# EAGLE design Nappe2.0 _ V2 (EAGLE 9.6.2)
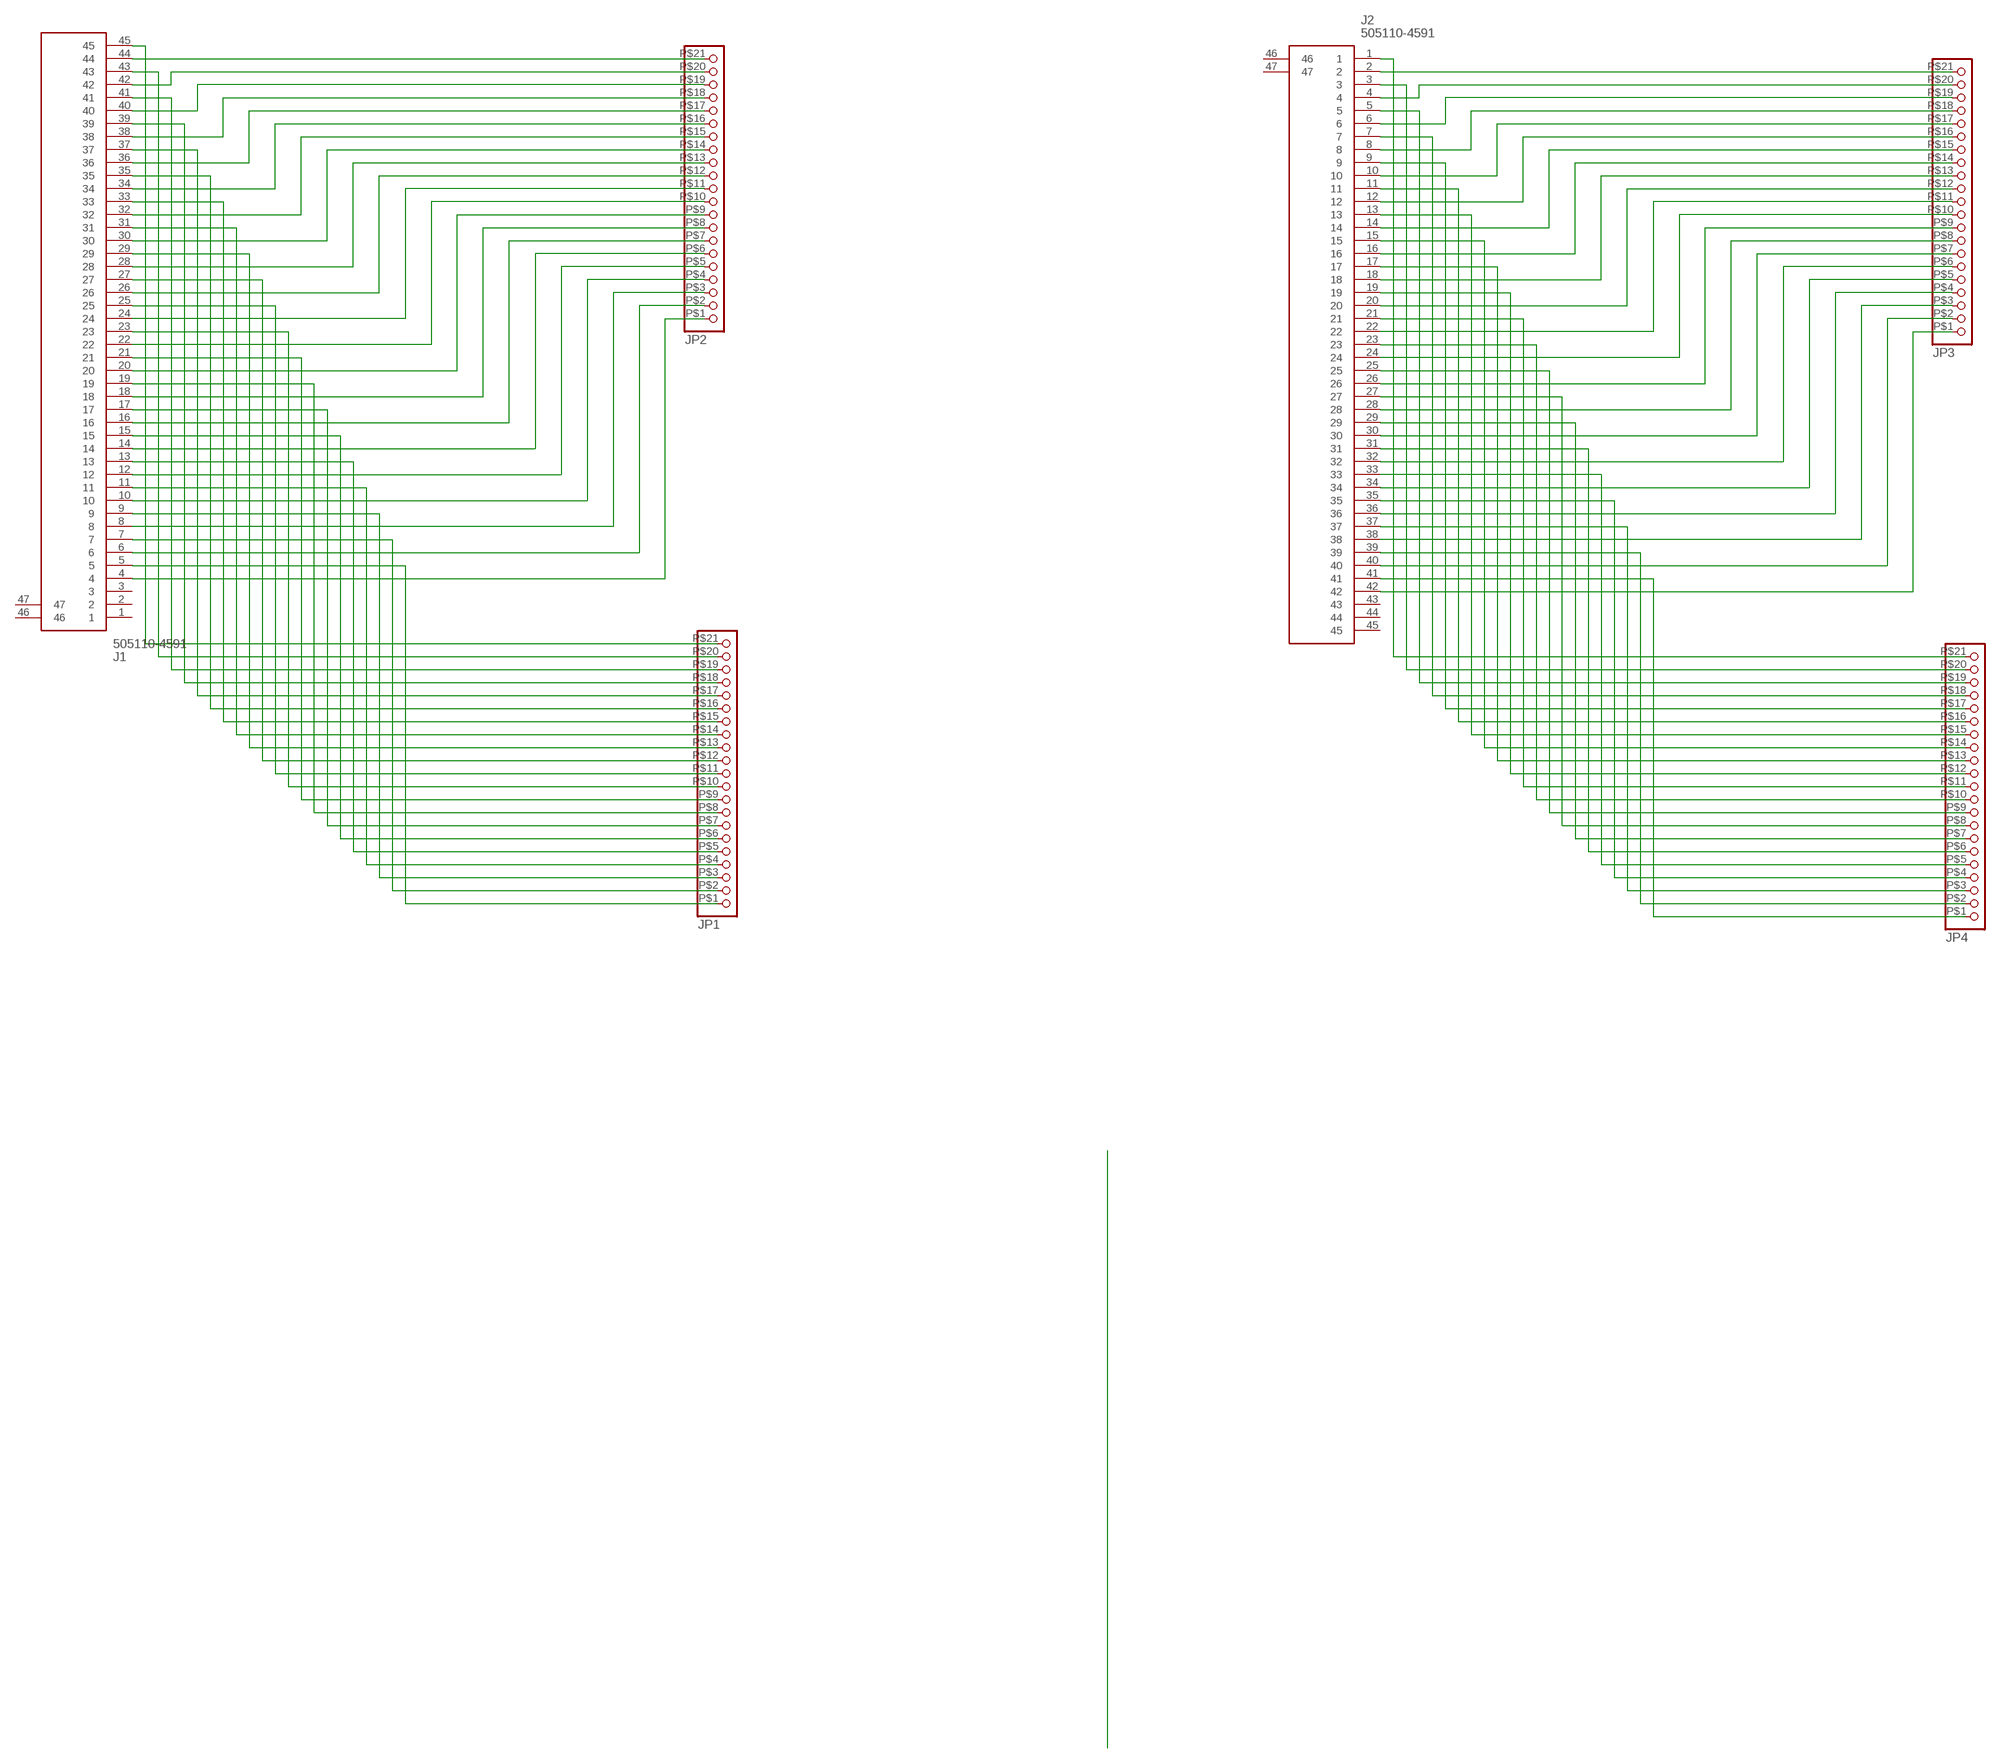
[diagram p0: schematic, sheet 1]

## Parts
J1  505110-4591  [5051104591]
J2  505110-4591  [5051104591]
JP1  PINHD-1X21(2.5)  [1X21(2.5)]
JP2  PINHD-1X21(2.5)  [1X21(2.5)]
JP3  PINHD-1X21(2.5)  [1X21(2.5)]
JP4  PINHD-1X21(2.5)  [1X21(2.5)]

## Nets
N$1: J2.2 JP3.P$21
N$6: J2.3 JP4.P$20
N$9: J2.26 JP3.P$9
N$10: J2.4 JP3.P$20
N$13: J2.6 JP3.P$19
N$14: J2.28 JP3.P$8
N$15: J2.18 JP3.P$13
N$16: J2.8 JP3.P$18
N$17: J2.10 JP3.P$17
N$19: J2.12 JP3.P$16
N$22: J2.14 JP3.P$15
N$23: J2.16 JP3.P$14
N$24: J2.20 JP3.P$12
N$25: J2.22 JP3.P$11
N$26: J2.24 JP3.P$10
N$27: J2.30 JP3.P$7
N$28: J2.32 JP3.P$6
N$29: J2.34 JP3.P$5
N$30: J2.36 JP3.P$4
N$31: J2.42 JP3.P$1
N$32: J2.40 JP3.P$2
N$33: J2.38 JP3.P$3
N$34: J2.1 JP4.P$21
N$35: J2.5 JP4.P$19
N$36: J2.7 JP4.P$18
N$37: J2.9 JP4.P$17
N$38: J2.11 JP4.P$16
N$39: J2.13 JP4.P$15
N$40: J2.15 JP4.P$14
N$41: J2.17 JP4.P$13
N$42: J2.41 JP4.P$1
N$43: J1.44 JP2.P$21
N$44: J1.42 JP2.P$20
N$45: J1.40 JP2.P$19
N$46: J2.27 JP4.P$8
N$47: J1.38 JP2.P$18
N$48: J1.36 JP2.P$17
N$49: J2.33 JP4.P$5
N$50: J1.34 JP2.P$16
N$51: J1.32 JP2.P$15
N$52: J2.21 JP4.P$11
N$53: J2.23 JP4.P$10
N$54: J2.25 JP4.P$9
N$55: J1.30 JP2.P$14
N$56: J2.29 JP4.P$7
N$57: J2.31 JP4.P$6
N$59: J2.39 JP4.P$2
N$60: J2.37 JP4.P$3
N$61: J2.35 JP4.P$4
N$62: J2.19 JP4.P$12
N$63: J1.28 JP2.P$13
N$64: J1.26 JP2.P$12
N$65: J1.24 JP2.P$11
N$66: J1.22 JP2.P$10
N$67: J1.20 JP2.P$9
N$68: J1.18 JP2.P$8
N$69: J1.16 JP2.P$7
N$70: J1.14 JP2.P$6
N$71: J1.12 JP2.P$5
N$72: J1.10 JP2.P$4
N$73: J1.6 JP2.P$2
N$74: J1.8 JP2.P$3
N$75: J1.4 JP2.P$1
N$77: J1.45 JP1.P$21
N$78: J1.43 JP1.P$20
N$79: J1.41 JP1.P$19
N$80: J1.39 JP1.P$18
N$81: J1.37 JP1.P$17
N$82: J1.35 JP1.P$16
N$83: J1.33 JP1.P$15
N$84: J1.31 JP1.P$14
N$85: J1.29 JP1.P$13
N$86: J1.19 JP1.P$8
N$88: J1.25 JP1.P$11
N$89: J1.23 JP1.P$10
N$90: J1.21 JP1.P$9
N$91: J1.17 JP1.P$7
N$92: J1.15 JP1.P$6
N$93: J1.13 JP1.P$5
N$96: J1.7 JP1.P$2
N$98: J1.9 JP1.P$3
N$99: J1.11 JP1.P$4
N$100: J1.27 JP1.P$12
N$101: J1.5 JP1.P$1
Unconnected: J1.1 J1.2 J1.3 J1.46 J1.47 J2.43 J2.44 J2.45 J2.46 J2.47

## Library data of the parts
J1 J2 = Molex - 505110-4591:505110-4591: MOLEX - 505110-4591 - CONNECTOR, FFC/FPC, 45POS, 1ROW, 0.5MM Source: Datasheet <https://www.molex.com/pdm_docs/sd/5051104591_sd.pdf>; DESCRIPTION: MOLEX - 505110-4591 - CONNECTOR, FFC/FPC, 45POS, 1ROW, 0.5MM; HEIGHT: 2.1mm; MANUFACTURER_NAME: Molex; MANUFACTURER_PART_NUMBER: 505110-4591; MOUSER_PART_NUMBER: 538-505110-4591; MOUSER_PRICE-STOCK: https://www.mouser.co.uk/ProductDetail/Molex/505110-4591?qs=fSIr1QPo%2F%2FReZXIaVbuxKA%3D%3D
JP1-JP4 = pinhead:PINHD-1X21(2.5): PIN HEADER

## Board
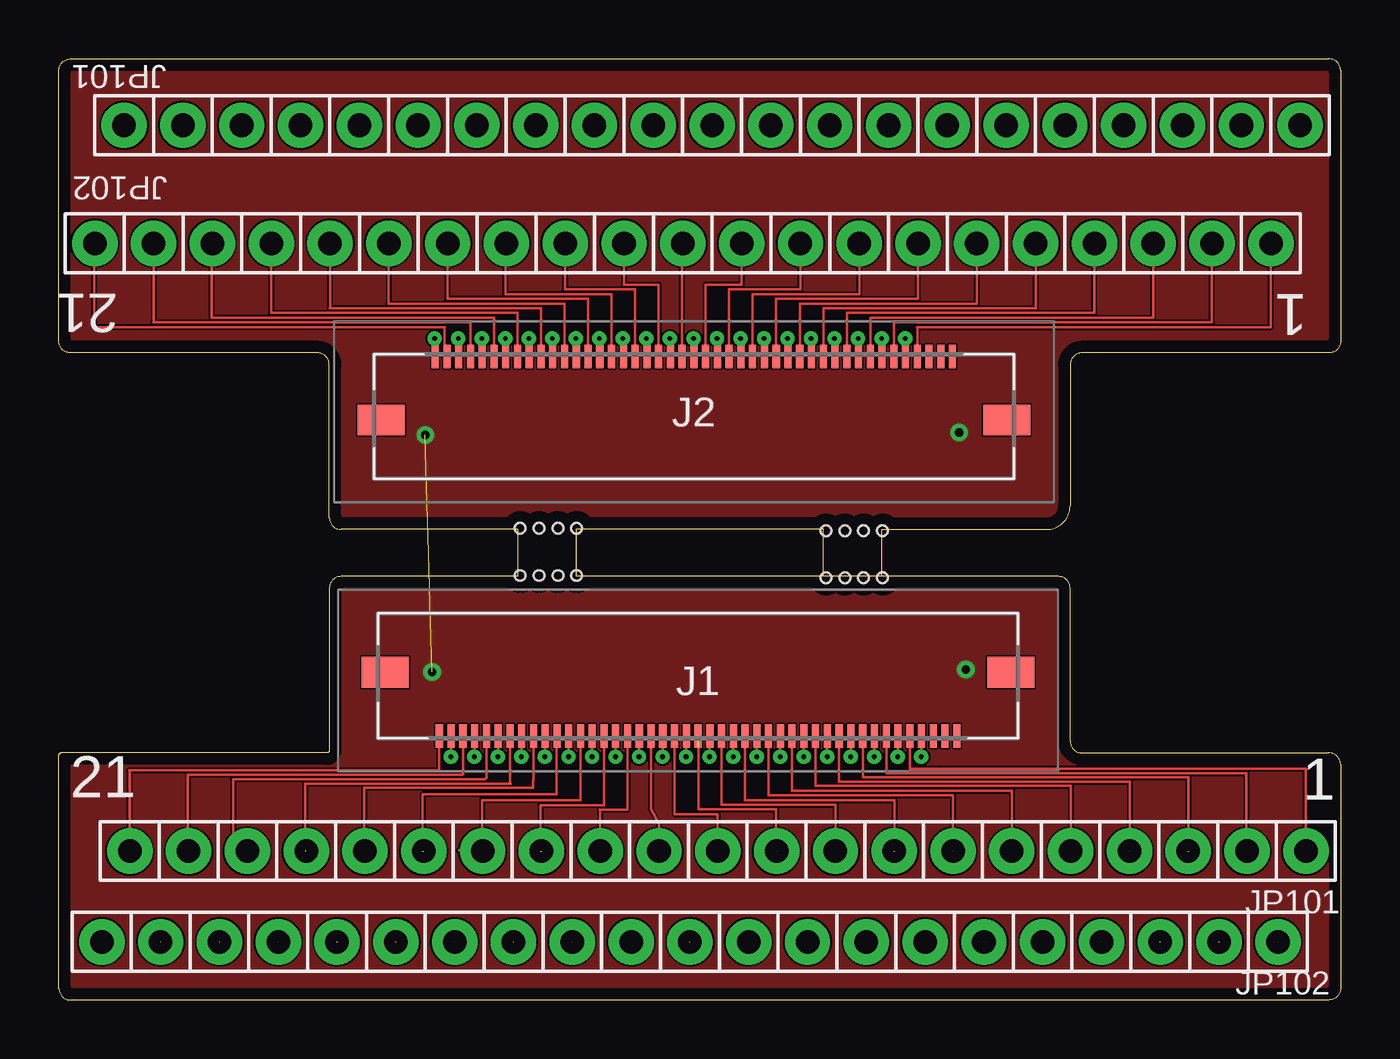
[diagram p1: board, top side]
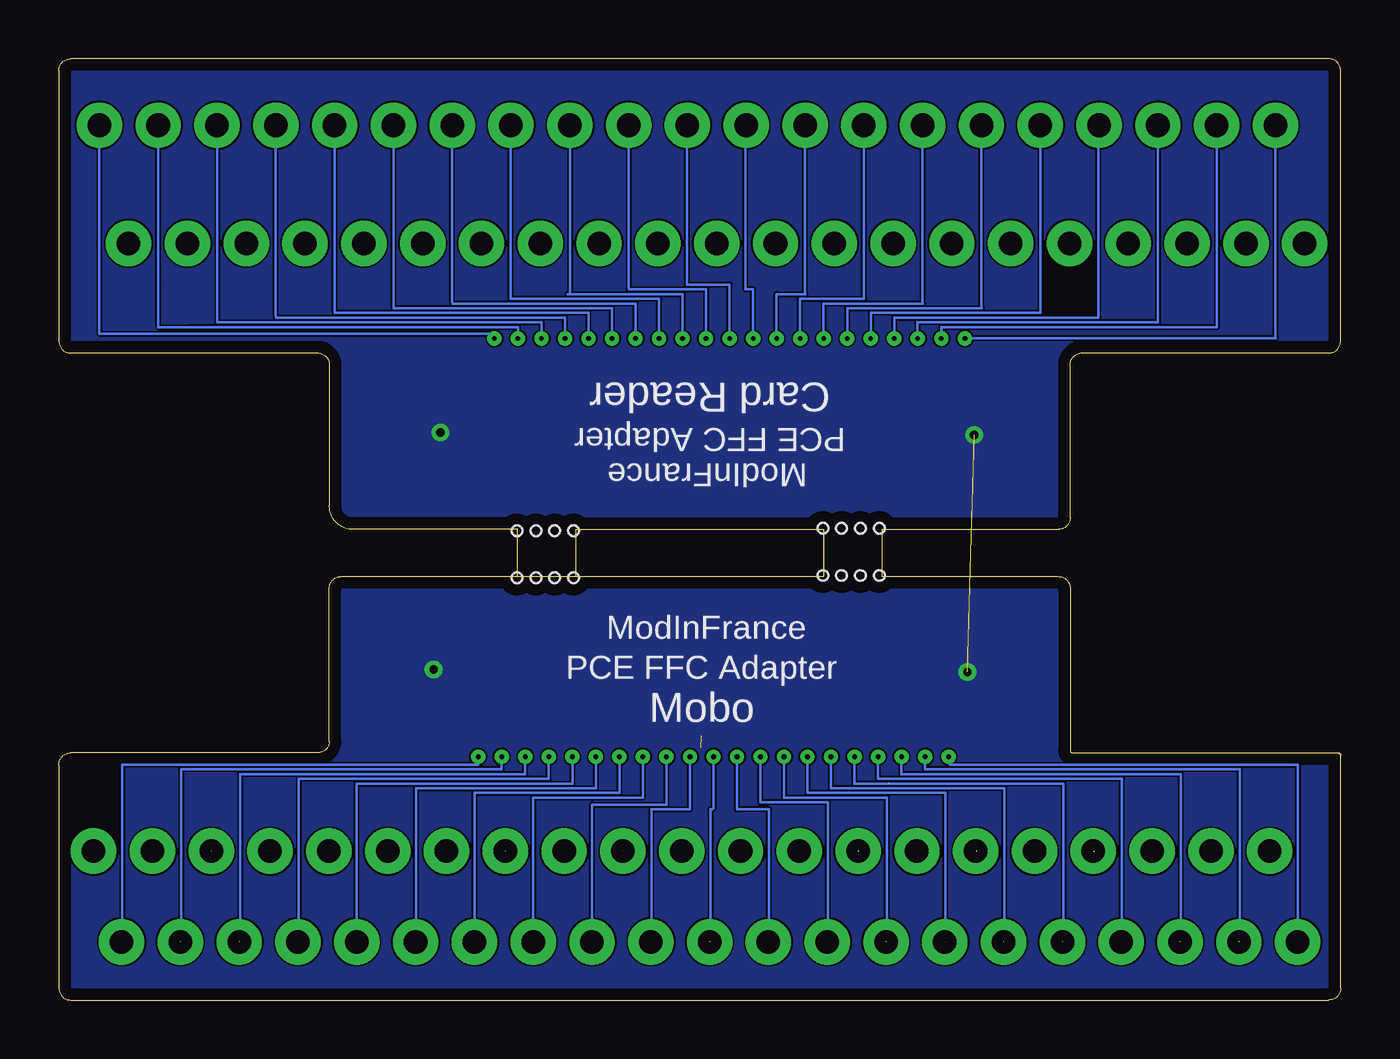
[diagram p2: board, bottom side, seen from below]

Size 54.5 x 40 mm. Coordinates in mm from the lower left corner, seen from the top.
Outline: 35,18 42.5,18 arc-90 43,17.5 43,11 arc90 43.5,10.5 54,10.5 arc-90 54.5,10 54.5,0.5 arc-90 54,0 0.5,0 arc-90 0,0.5 0,10.4 arc-90 0.1,10.5 11.4,10.5 arc90 11.5,10.6 11.5,17.5 arc-90 12,18 19.5,18 19.5,20 12,20 arc-90 11.5,20.5 11.5,27 arc90 11,27.5 0.5,27.5 arc-90 0,28 0,39.5 arc-90 0.5,40 54,40 arc-90 54.5,39.5 54.5,28 arc-90 54,27.5 43.5,27.5 arc90 43,27 43,21 arc-90 42,20 35,20 35,18
Outline: 35,18 32.5,18
Outline: 32.5,18 22,18 22,20 32.5,20 32.5,18
Copper layers (1*16): Top 0.035mm / dielectric 1.5mm / Bottom 0.035mm
Design rules "default *": minimum track width 3mil, minimum drill 0.2mm, track to track 3mil, track to pad 3mil, pad to pad 3mil, via to via 3mil, smd to smd 3mil, copper to edge 20mil, drill to drill 3mil, minimum pad ring 10mil, minimum via ring 8mil, stop-mask expansion 4mil, vias tented up to drill 0mil, thermal gap 10mil
Holes 0.45 mm at 19.62,20.04 20.42,20.04 21.22,20.04 22.02,20.04 19.62,18.04 20.42,18.04 21.22,18.04 22.02,18.04 32.62,17.94 33.42,17.94 34.22,17.94 35.02,17.94 32.62,19.94 33.42,19.94 34.22,19.94 35.02,19.94

### Footprints (pad centres in the part's own frame; a part is rotated, then mirrored left to right if it is on the bottom)
5051104591 = smd 0.3 x 1: 1 -11,2.35; 2 -10.5,2.35; 3 -10,2.35; 4 -9.5,2.35; 5 -9,2.35; 6 -8.5,2.35; 7 -8,2.35; 8 -7.5,2.35; 9 -7,2.35; 10 -6.5,2.35; 11 -6,2.35; 12 -5.5,2.35; 13 -5,2.35; 14 -4.5,2.35; 15 -4,2.35; 16 -3.5,2.35; 17 -3,2.35; 18 -2.5,2.35; 19 -2,2.35; 20 -1.5,2.35; 21 -1,2.35; 22 -0.5,2.35; 23 0,2.35; 24 0.5,2.35; 25 1,2.35; 26 1.5,2.35; 27 2,2.35; 28 2.5,2.35; 29 3,2.35; 30 3.5,2.35; 31 4,2.35; 32 4.5,2.35; 33 5,2.35; 34 5.5,2.35; 35 6,2.35; 36 6.5,2.35; 37 7,2.35; 38 7.5,2.35; 39 8,2.35; 40 8.5,2.35; 41 9,2.35; 42 9.5,2.35; 43 10,2.35; 44 10.5,2.35; 45 11,2.35 | smd 2 x 1.3: 46 -13.3,-0.35; 47 13.3,-0.35
1X21(2.5) = drill 1 pad 1.93: P$1 -25,0; P$2 -22.5,0; P$3 -20,0; P$4 -17.5,0; P$5 -15,0; P$6 -12.5,0; P$7 -10,0; P$8 -7.5,0; P$9 -5,0; P$10 -2.5,0; P$11 0,0; P$12 2.5,0; P$13 5,0; P$14 7.5,0; P$15 10,0; P$16 12.5,0; P$17 15,0; P$18 17.5,0; P$19 20,0; P$20 22.5,0; P$21 25,0

### Placement (x,y rotation side)
J1  27.18,13.58 180 top
J2  27,25 0 top
JP1  28.02,6.33 180 top
JP2  26.83,2.47 180 top
JP3  26.53,32.16 180 top
JP4  27.77,37.18 180 top

### Tracks (layer width: path | path; a pad name or v marks a point on that pad's centre or on a via)
GND  (via drill 0.35)  (1 unrouted)
  other vias: 15.87,13.94 38.57,14.04 38.28,24.12 15.58,24.02
  pour Bottom: 0,40.1 54.5,40.1 54.5,0.1 0,0.1
  pour Top (rank 6): 0,40.1 54.5,40.1 54.5,0.1 0,0.1
N$1
  Top 0.102: J2.2 16.4,27.35 16.4,28.6 1.5,28.6 1.5,32.16 JP3.P$21
N$6  (via drill 0.2)
  Top 0.102: v16.98,28.12 17,28.12 J2.3
  Bottom 0.102: JP4.P$20 5.27,28.69 5.26,28.6 16.98,28.6 v16.98,28.12
N$9
  Top 0.102: J2.26 28.5,30.2 31.53,30.2 JP3.P$9
N$10
  Top 0.102: JP3.P$20 4.03,28.83 4.02,28.8 17.5,28.8 J2.4
N$13
  Top 0.102: J2.6 18.5,29 6.5,29 6.5,32.16 JP3.P$19
N$14
  Top 0.102: J2.28 29.5,30 34.03,30 JP3.P$8
N$15
  Top 0.102: JP3.P$13 21.53,30.22 21.52,30.2 24.5,30.2 J2.18
N$16
  Top 0.102: JP3.P$18 9.03,29.23 9.02,29.2 19.5,29.2 J2.8
N$17
  Top 0.102: J2.10 20.5,29.4 11.52,29.4 11.53,29.43 JP3.P$17
N$19
  Top 0.102: JP3.P$16 14.03,29.62 14.02,29.6 21.5,29.6 J2.12
N$22
  Top 0.102: J2.14 22.5,29.8 16.52,29.8 16.53,29.82 JP3.P$15
N$23
  Top 0.102: JP3.P$14 19,32.16 19,30 23.5,30 J2.16
N$24
  Top 0.102: JP3.P$12 24.03,30.42 24.02,30.4 25.5,30.4 J2.20
N$25
  Top 0.102: JP3.P$11 26.5,32.01 J2.22
N$26
  Top 0.102: JP3.P$10 29.03,30.4 27.5,30.4 J2.24
N$27
  Top 0.102: J2.30 30.5,29.8 36.52,29.8 36.53,29.82 JP3.P$7
N$28
  Top 0.102: J2.32 31.5,29.6 39.02,29.6 39.03,29.62 JP3.P$6
N$29
  Top 0.102: J2.34 32.5,29.4 41.53,29.4 JP3.P$5
N$30
  Top 0.102: J2.36 33.5,29.2 44.02,29.2 44.03,29.23 JP3.P$4
N$31
  Top 0.102: J2.42 36.5,28.6 51.53,28.6 JP3.P$1
N$32
  Top 0.102: J2.40 35.5,28.8 49.03,28.8 JP3.P$2
N$33
  Top 0.102: J2.38 34.5,29 46.53,29 JP3.P$3
N$34  (via drill 0.2)
  Top 0.102: v15.98,28.12 16,28.12 J2.1
  Bottom 0.102: JP4.P$21 2.77,28.21 2.76,28.12 v15.98,28.12
N$35  (via drill 0.2)
  Top 0.102: v17.98,28.12 18,28.12 J2.5
  Bottom 0.102: JP4.P$19 7.77,28.88 7.76,28.8 18,28.8 18,28.12 v17.98,28.12
N$36  (via drill 0.2)
  Top 0.102: v18.98,28.12 19,28.12 J2.7
  Bottom 0.102: v18.98,28.12 18.98,29 10.3,29 10.3,37.18 JP4.P$18
N$37  (via drill 0.2)
  Top 0.102: v19.98,28.12 20,28.12 J2.9
  Bottom 0.102: JP4.P$17 12.77,29.28 12.76,29.2 19.98,29.2 v19.98,28.12
N$38  (via drill 0.2)
  Top 0.102: v20.98,28.12 21,28.12 J2.11
  Bottom 0.102: v20.98,28.12 20.98,29.4 15.26,29.4 15.27,29.48 JP4.P$16
N$39  (via drill 0.2)
  Top 0.102: v21.98,28.12 22,28.12 J2.13
  Bottom 0.102: JP4.P$15 17.77,29.67 17.76,29.6 21.98,29.6 v21.98,28.12
N$40  (via drill 0.2)
  Top 0.102: v22.98,28.12 23,28.12 J2.15
  Bottom 0.102: v22.98,28.12 22.98,29.8 20.26,29.8 20.27,29.87 JP4.P$14
N$41  (via drill 0.2)
  Top 0.102: v23.98,28.12 24,28.12 J2.17
  Bottom 0.102: v23.98,28.12 23.98,30 22.76,30 22.77,30.07 JP4.P$13
N$42  (via drill 0.2)
  Top 0.102: v35.98,28.12 36,28.12 J2.41
  Bottom 0.102: v35.98,28.12 36.18,28.32 52.77,28.32 JP4.P$1
N$43  (via drill 0.2)
  Top 0.102: J1.44 v16.68,10.34 v16.67,10.34
  Bottom 0.102: v16.67,10.34 16.67,10.06 16.61,10 1.82,10 1.83,9.93 JP2.P$21
N$44  (via drill 0.2)  (1 unrouted)
  Top 0.102: J1.42 v17.68,10.34 v17.67,10.34
  Bottom 0.102: JP2.P$20 4.3,2.47 4.3,9.8 17.67,9.8 v17.67,10.34
N$45  (via drill 0.2)  (1 unrouted)
  Top 0.102: J1.40 v18.68,10.34 v18.67,10.34
  Bottom 0.102: JP2.P$19 6.8,2.47 6.8,9.6 18.67,9.6 v18.67,10.34
N$46  (via drill 0.2)
  Top 0.102: v28.98,28.12 29,28.12 J2.27
  Bottom 0.102: v28.98,28.12 28.98,29.8 35.3,29.8 35.3,37.18 JP4.P$8
N$47  (via drill 0.2)  (1 unrouted)
  Top 0.102: J1.38 v19.68,10.34 v19.67,10.34
  Bottom 0.102: JP2.P$18 9.3,2.47 9.3,9.4 19.67,9.4 v19.67,10.34
N$48  (via drill 0.2)  (1 unrouted)
  Top 0.102: J1.36 v20.68,10.34 v20.67,10.34
  Bottom 0.102: JP2.P$17 11.8,2.47 11.8,9.2 20.67,9.2 v20.67,10.34
N$49  (via drill 0.2)
  Top 0.102: v31.98,28.12 32,28.12 J2.33
  Bottom 0.102: v31.98,28.12 31.98,29.2 42.76,29.2 42.77,29.28 JP4.P$5
N$50  (via drill 0.2)  (1 unrouted)
  Top 0.102: J1.34 v21.68,10.34 v21.67,10.34
  Bottom 0.102: JP2.P$16 14.3,2.47 14.3,9 21.67,9 v21.67,10.34
N$51  (via drill 0.2)  (1 unrouted)
  Top 0.102: J1.32 v22.68,10.34 v22.67,10.34
  Bottom 0.102: JP2.P$15 16.8,2.47 16.8,8.8 22.67,8.8 v22.67,10.34
N$52  (via drill 0.2)
  Top 0.102: v25.98,28.12 26,28.12 J2.21
  Bottom 0.102: v25.98,28.12 25.98,30.4 27.8,30.4 27.8,37.18 JP4.P$11
N$53  (via drill 0.2)
  Top 0.102: v26.98,28.12 27,28.12 J2.23
  Bottom 0.102: v26.98,28.12 26.98,30.2 30.26,30.2 30.27,30.27 JP4.P$10
N$54  (via drill 0.2)
  Top 0.102: v27.98,28.12 28,28.12 J2.25
  Bottom 0.102: JP4.P$9 32.77,30.01 32.86,30 27.98,30 v27.98,28.12
N$55  (via drill 0.2)  (1 unrouted)
  Top 0.102: J1.30 v23.68,10.34 v23.67,10.34
  Bottom 0.102: v23.67,10.34 23.67,8.6 19.3,8.6 19.3,2.47 JP2.P$14
N$56  (via drill 0.2)
  Top 0.102: v29.98,28.12 30,28.12 J2.29
  Bottom 0.102: v29.98,28.12 29.98,29.6 37.76,29.6 37.77,29.67 JP4.P$7
N$57  (via drill 0.2)
  Top 0.102: v30.98,28.12 31,28.12 J2.31
  Bottom 0.102: v30.98,28.12 30.98,29.4 40.26,29.4 40.27,29.48 JP4.P$6
N$59  (via drill 0.2)
  Top 0.102: v34.98,28.12 35,28.12 J2.39
  Bottom 0.102: v34.98,28.12 34.98,28.6 48.9,28.6 50.27,28.6 50.27,28.63 50.27,30.3 JP4.P$2
N$60  (via drill 0.2)
  Top 0.102: v33.98,28.12 34,28.12 J2.37
  Bottom 0.102: v33.98,28.12 33.98,28.8 47.77,28.8 JP4.P$3
N$61  (via drill 0.2)
  Top 0.102: v32.98,28.12 33,28.12 J2.35
  Bottom 0.102: v32.98,28.12 32.98,29 45.26,29 45.27,29.08 JP4.P$4
N$62  (via drill 0.2)
  Top 0.102: v24.98,28.12 25,28.12 J2.19
  Bottom 0.102: v24.98,28.12 24.98,30.2 25.3,30.2 25.3,37.18 JP4.P$12
N$63  (via drill 0.2)  (1 unrouted)
  Top 0.102: J1.28 v24.68,10.34 v24.67,10.34
  Bottom 0.102: JP2.P$13 21.8,2.47 21.8,8.4 24.67,8.4 v24.67,10.34
N$64  (via drill 0.2)
  Top 0.102: v25.67,10.34 v25.68,10.33 J1.26
  Bottom 0.102: JP2.P$12 24.3,2.47 24.3,8.1 25.67,8.1 v25.67,10.34
N$65  (via drill 0.2)  (1 unrouted)
  Top 0.102: v26.67,10.34 26.67,11.23 J1.24
  Bottom 0.102: v26.67,10.34 26.67,8.14 26.71,8.1 26.8,8.1 26.8,2.47 JP2.P$11
N$66  (via drill 0.2)
  Top 0.102: v27.67,10.34 27.67,11.23 J1.22
  Bottom 0.102: JP2.P$10 29.3,2.47 29.3,8.1 27.67,8.1 v27.67,10.34
N$67  (via drill 0.2)
  Top 0.102: v28.67,10.34 28.67,11.23 J1.20
  Bottom 0.102: JP2.P$9 31.83,8.24 31.82,8.3 28.67,8.3 v28.67,10.34
N$68  (via drill 0.2)
  Top 0.102: v29.67,10.34 29.67,11.23 J1.18
  Bottom 0.102: JP2.P$8 34.33,8.6 29.67,8.6 v29.67,10.34
N$69  (via drill 0.2)
  Top 0.102: v30.67,10.34 30.67,11.23 J1.16
  Bottom 0.102: JP2.P$7 36.83,8.8 30.67,8.8 v30.67,10.34
N$70  (via drill 0.2)  (1 unrouted)
  Top 0.102: v31.67,10.34 31.67,11.23 J1.14
  Bottom 0.102: JP2.P$6 39.3,2.47 39.3,9 31.67,9 v31.67,10.34
N$71  (via drill 0.2)
  Top 0.102: v32.67,10.34 32.67,11.23 J1.12
  Bottom 0.102: JP2.P$5 41.83,9.2 32.67,9.2 v32.67,10.34
N$72  (via drill 0.2)  (1 unrouted)
  Top 0.102: v33.67,10.34 33.67,11.23 J1.10
  Bottom 0.102: JP2.P$4 44.3,2.47 44.3,9.4 33.67,9.4 v33.67,10.34
N$73  (via drill 0.2)  (1 unrouted)
  Top 0.102: v35.67,10.34 35.67,11.23 J1.6
  Bottom 0.102: JP2.P$2 49.3,2.47 49.3,9.8 35.67,9.8 v35.67,10.34
N$74  (via drill 0.2)  (1 unrouted)
  Top 0.102: v34.67,10.34 34.67,11.23 J1.8
  Bottom 0.102: 34.67,9.94 v34.67,10.34 34.67,9.6 46.8,9.6 46.8,2.47 JP2.P$3
N$75  (via drill 0.2)  (1 unrouted)
  Top 0.102: v36.67,10.34 36.67,11.23 J1.4
  Bottom 0.102: JP2.P$1 51.8,2.47 51.8,10 36.67,10 v36.67,10.34
N$77
  Top 0.102: JP1.P$21 3.02,9.67 2.99,9.76 16.15,9.76 16.18,9.79 J1.45
N$78
  Top 0.102: J1.43 17.18,9.6 17.14,9.56 5.48,9.56 5.48,6.33 5.51,6.33 JP1.P$20
N$79
  Top 0.102: J1.41 18.18,9.44 18.12,9.38 7.41,9.38 7.41,6.56 JP1.P$19
N$80  (2 unrouted)
  Top 0.102: J1.39 19.18,9.23 | 19.21,9.2 10.48,9.2 10.48,6.33
N$81
  Top 0.102: J1.37 20.18,9.34 20.17,9.34 20.17,9.02 12.98,9.02 12.98,6.33 13.01,6.33 JP1.P$17
N$82  (1 unrouted)
  Top 0.102: J1.35 21.17,8.74 15.48,8.74 15.48,6.33
N$83
  Top 0.102: 17.01,6.36 JP1.P$15 18,6.33 18,8.5 22.18,8.5 J1.33
N$84  (1 unrouted)
  Top 0.102: J1.31 23.17,8.28 20.47,8.28 20.47,6.33
N$85
  Top 0.102: J1.29 24.18,9.14 24.17,9.14 24.17,8.1 22.99,8.1 23.02,8.05 JP1.P$13
N$86  (1 unrouted)
  Top 0.102: 35.51,6.33 JP1.P$8 35.52,8.5 29.18,8.5 J1.19
N$88
  Top 0.102: J1.25 26.18,7.9 28,7.9 28,6.33 JP1.P$11
N$89  (2 unrouted)
  Top 0.102: 30.51,6.33 30.5,6.34 30.5,8.1 27.2,8.1 27.2,10.73
N$90
  Top 0.102: JP1.P$9 33.01,8.3 28.18,8.3 J1.21
N$91  (1 unrouted)
  Top 0.102: 38.01,6.33 JP1.P$7 38.02,8.7 30.18,8.7 J1.17
N$92
  Top 0.102: JP1.P$6 40.52,8.9 31.18,8.9 J1.15
N$93
  Top 0.102: JP1.P$5 43.02,9.09 32.18,9.09 J1.13
N$96
  Top 0.102: JP1.P$2 50.49,6.33 50.49,9.64 35.18,9.64 J1.7
N$98  (1 unrouted)
  Top 0.102: 48.01,6.33 JP1.P$3 48.03,9.46 34.18,9.46 J1.9
N$99  (1 unrouted)
  Top 0.102: 45.51,6.33 45.53,6.33 45.53,9.28 33.18,9.28 J1.11
N$100
  Top 0.102: J1.27 25.17,8.11 25.52,7.5 JP1.P$12
N$101
  Top 0.102: JP1.P$1 53.02,9.82 36.18,9.82 J1.5

### Text on the board
tNames: JP101 | JP102 | 21 | 1 | 21 | 1 | JP101 | JP102
bNames: Card Reader | PCE FFC Adapter | ModInFrance | ModInFrance | PCE FFC Adapter | Mobo